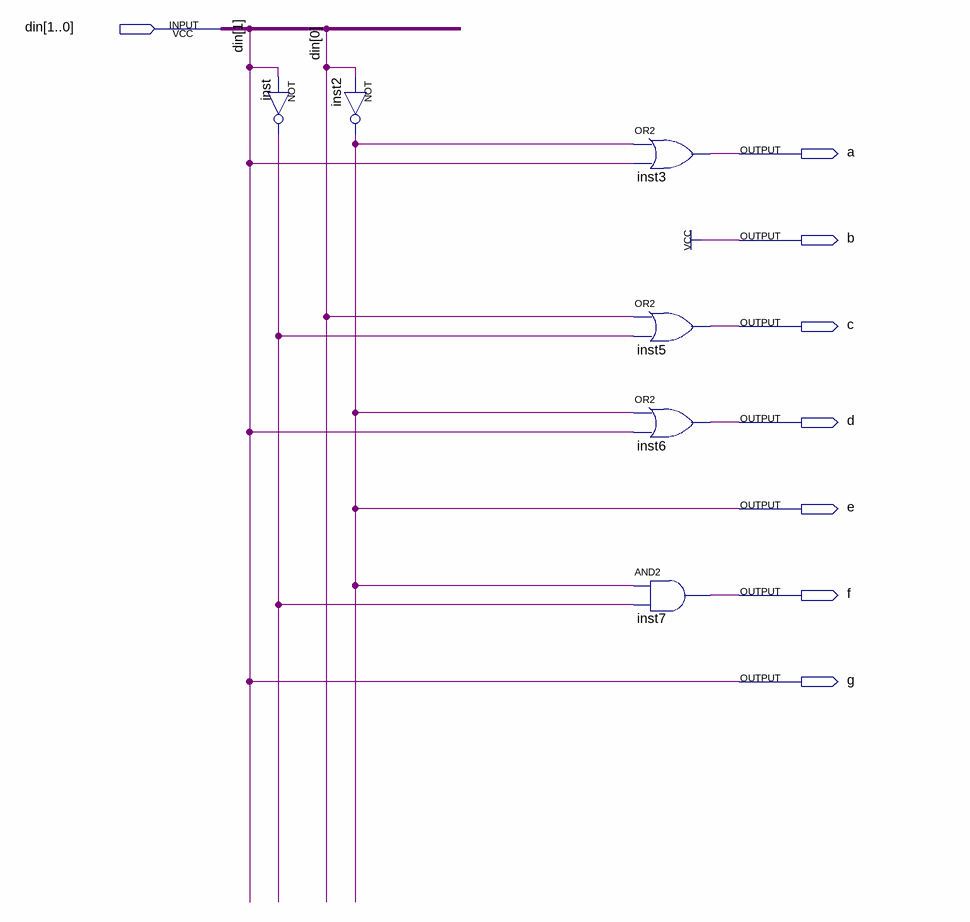
[diagram p0: schematic sheet]
// Quartus schematic BinaryToSeg2Bit.bdf as structural Verilog: 6 symbols, 8 pins
module BinaryToSeg2Bit (
  input  [1:0] din,
  output a,
  output b,
  output c,
  output d,
  output e,
  output f,
  output g
);

  wire inst_out;

  not inst (inst_out, din[1]);
  not inst2 (e, din[0]);
  or inst3 (a, e, din[1]);
  or inst5 (c, din[0], inst_out);
  or inst6 (d, e, din[1]);
  and inst7 (f, e, inst_out);

  assign b = 1'b1;
  assign g = din[1];
endmodule
